# EasyEDA schematic PWM2CV_AtMega_2020-12-24_12-28-22.json
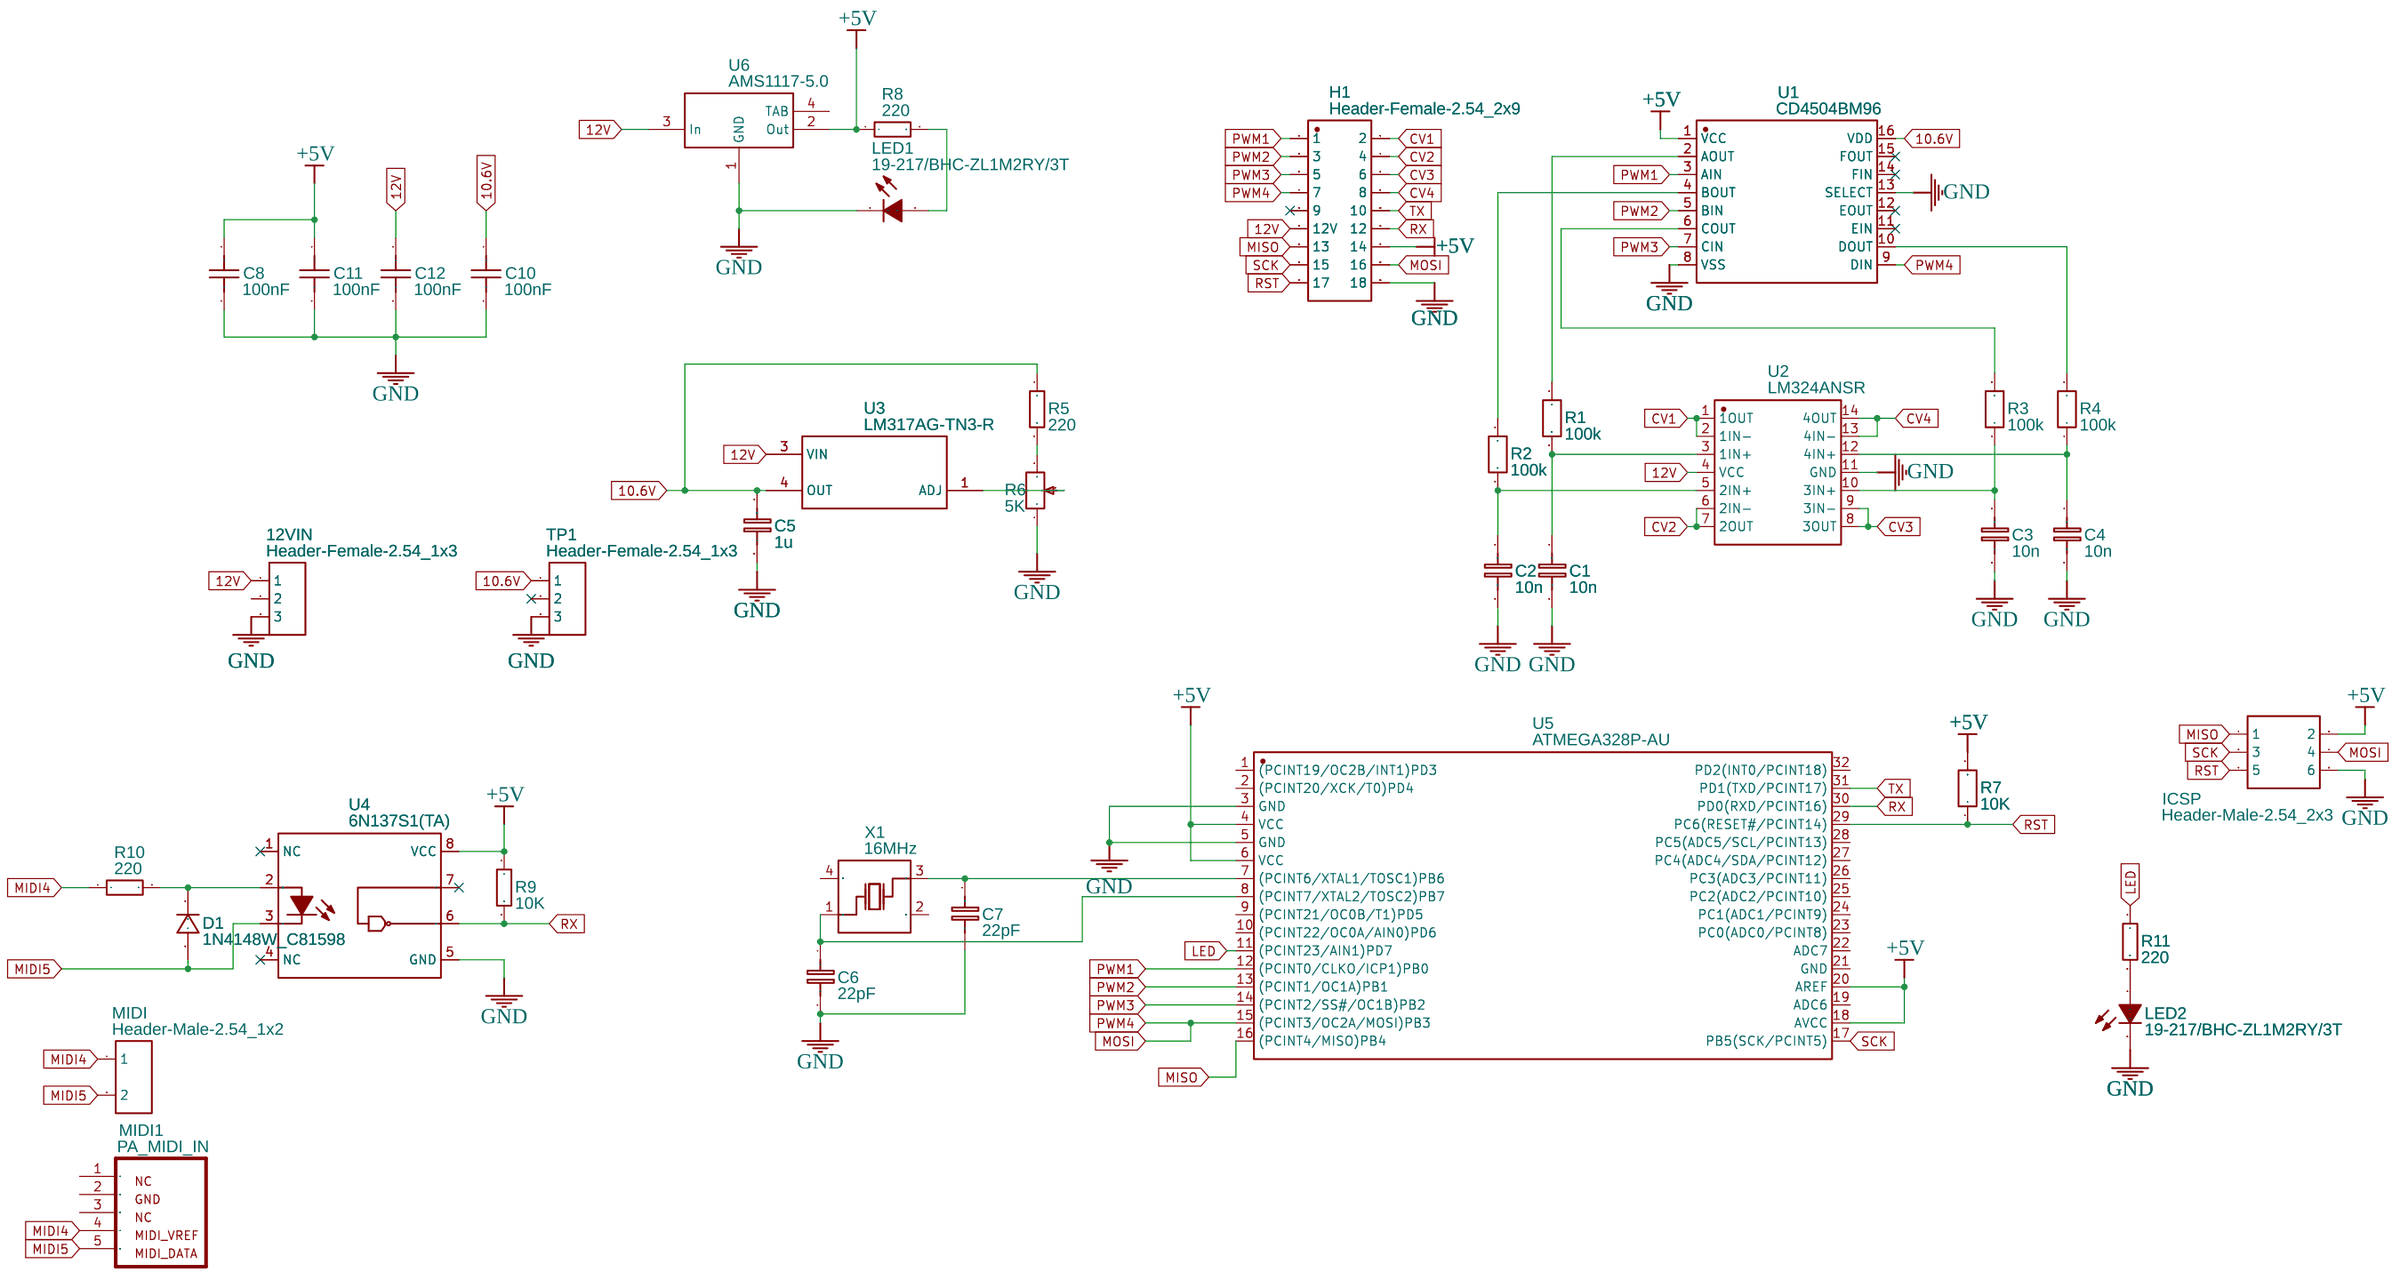
[diagram p0: schematic sheet]

## Parts
12VIN  Header-Female-2.54_1x3  [HDR-TH_3P-P2.54-V]
C1  10n  [C0603]
C2  10n  [C0603]
C3  10n  [C0603]
C4  10n  [C0603]
C5  1u  [C0603]
C6  22pF  [C0603]
C7  22pF  [C0603]
C8  100nF  [C0603]
C10  100nF  [C0603]
C11  100nF  [C0603]
C12  100nF  [C0603]
D1  1N4148W_C81598  [SOD-123_L2.8-W1.8-LS3.7-RD]
H1  Header-Female-2.54_2x9  [HDR-TH_18P-P2.54-V-R2-C9-S2.54]
ICSP  Header-Male-2.54_2x3  [HDR-TH_6P-P2.54-V-R2-C3-S2.54]
LED1  19-217/BHC-ZL1M2RY/3T  [LED0603-R-RD]
LED2  19-217/BHC-ZL1M2RY/3T  [LED0603-R-RD]
MIDI  Header-Male-2.54_1x2  [HDR-TH_2P-P2.54-V]
MIDI1  PA_MIDI_IN  [PA_DIN_5_FEMALE]
R1  100k  [R0603]
R2  100k  [R0603]
R3  100k  [R0603]
R4  100k  [R0603]
R5  220  [R0603]
R6  5K  [RES-ADJ_3314J]
R7  10K  [R0603]
R8  220  [R0603]
R9  10K  [R0603]
R10  220  [R0603]
R11  220  [R0603]
TP1  Header-Female-2.54_1x3  [HDR-TH_3P-P2.54-V]
U1  CD4504BM96  [SOIC-16_L9.9-W3.9-P1.27-LS6.0-BL]
U2  LM324ANSR  [SOIC-14_L10.0-W5.5-P1.27-LS7.8-BL]
U3  LM317AG-TN3-R  [TO-252-2_L6.5-W6.1-P4.58-LS10.0-TL]
U4  6N137S1(TA)  [SMD-8_L9.8-W6.6-P2.54-LS10.3-BL]
U5  ATMEGA328P-AU  [TQFP-32_L7.0-W7.0-P0.80-LS9.0-BL]
U6  AMS1117-5.0  [SOT-223_L6.5-W3.5-P2.30-LS7.0-BR]
X1  16MHz  [OSC-SMD_4P-L3.2-W2.5-BL]

## Library data of the parts
12VIN TP1 = Header-Female-2.54_1x3: Supplier Part: C146243; Supplier: LCSC; Manufacturer: Boom Precision Elec; link: https://datasheet.lcsc.com/szlcsc/Boom-Precision-Elec-2-54mm-1-8P-Straight-Female-header_C27438.pdf
C1-C4 = C_0603_EU: Supplier Part: C57112; Supplier: LCSC; Contributor: LCEDA_Lib; Manufacturer Part: 0603B103K500NT; Manufacturer: FH
C5 = C_0603_EU: Supplier Part: C15849; Supplier: LCSC; Contributor: LCEDA_Lib; Manufacturer Part: CL10A105KB8NNNC; Manufacturer: SAMSUNG
C6 C7 = C_0603_EU: Supplier Part: C1653; Supplier: LCSC; Contributor: LCEDA_Lib; Manufacturer Part: CL10C220JB8NNNC; Manufacturer: SAMSUNG
C8 C10-C12 = CC0603KRX7R9BB104: Supplier: LCSC; Manufacturer: YAGEO; LCSC Assembly: Yes; Supplier Part: C14663; SMT Type: Basic
D1 = 1N4148W_C81598: Supplier: LCSC; Manufacturer: SEMTECH; Manufacturer Part: 1N4148W; image: //image.lceda.cn/szlcsc/C81598.jpg; Supplier Part: C81598; LCSC Assembly: Yes; SMT Type: Basic
H1 = Header-Female-2.54_2x9: Supplier: LCSC; Manufacturer: BOOMELE; image: //image.lceda.cn/szlcsc/C71956.jpg; Supplier Part: C71956
ICSP = Header-Male-2.54_2x3: Supplier: LCSC; Manufacturer: BOOMELE; Supplier Part: C65114
LED1 LED2 = 19-217/BHC-ZL1M2RY/3T: Supplier: LCSC; Manufacturer: EVERLIGHT; LCSC Assembly: Yes; image: //image.lceda.cn/szlcsc/C72041.jpg; Supplier Part: C72041; SMT Type: Basic
MIDI = Header-Male-2.54_1x2: Supplier: LCSC; Manufacturer: TE Connectivity; Manufacturer Part: 826629-2; image: //image.lceda.cn/szlcsc/C86471.jpg; Supplier Part: C86471
MIDI1 = PA_MIDI_OUT: PatternAgents MIDI OUT Pattern; Contributor: PatternAgents
R1-R4 = R_0603_EU: Supplier Part: C25803; Supplier: LCSC; Contributor: LCEDA_Lib; Manufacturer Part: 0603WAF1003T5E; Manufacturer: UniOhm
R5 R8 R10 R11 = 0603WAF2200T5E: Supplier: LCSC; Manufacturer: UniOhm; LCSC Assembly: Yes; Supplier Part: C22962; SMT Type: Basic
R6 = 3314J-1-502E: Supplier: LCSC; Manufacturer: BOURNS; Supplier Part: C58391
R7 = R_0603_EU: Supplier Part: C25803; Supplier: LCSC; Contributor: LCEDA_Lib; Manufacturer Part: 0603WAF1003T5E; Manufacturer: UniOhm; Package Display: No
R9 = 0603WAF1002T5E: Supplier: LCSC; Manufacturer: UniOhm; LCSC Assembly: Yes; Supplier Part: C25804; SMT Type: Basic
U1 = CD4504BM96: Supplier: LCSC; Supplier Part: C151885; Manufacturer: Texas Instruments; Contributor: LCSC; LCSC Assembly: Yes; SMT Type: Extend
U2 = LM324ANSR: Supplier: LCSC; Manufacturer: TI; Supplier Part: C111853; LCSC Assembly: Yes; SMT Type: Extend
U3 = LM317AG-TN3-R: Supplier: LCSC; Manufacturer: UTC; LCSC Assembly: Yes; image: //image.lceda.cn/szlcsc/C75510.jpg; Supplier Part: C75510; SMT Type: Basic
U4 = 6N137S1(TA): Supplier: LCSC; Supplier Part: C110020; Manufacturer: Everlight Elec; Contributor: LCSC; SMT Type: Basic; LCSC Assembly: Yes
U5 = ATMEGA328P-AU: Supplier: LCSC; Manufacturer: MICROCHIP; image: //image.lceda.cn/szlcsc/C14877.jpg; Supplier Part: C14877; LCSC Assembly: Yes; SMT Type: Basic
U6 = AMS1117-5.0: sourceId: HltLFyQwq; Supplier: LCSC; Manufacturer: AMS; LCSC Assembly: Yes; image: //image.lceda.cn/szlcsc/C6187.jpg; Supplier Part: C6187; SMT Type: Basic
X1 = X322516MLB4SI: Supplier: LCSC; Manufacturer: YXC; LCSC Assembly: Yes; Supplier Part: C13738; SMT Type: Basic

## Nets
10.6V: C5.1 C10.1 R5.1 TP1.1 U1.16(VDD) U3.4(OUT)
12V: 12VIN.1 C12.1 H1.11(12V) U2.4(VCC) U3.3(VIN) U6.3(In)
+5V: C8.1 C11.1 H1.14 ICSP.2 R7.2 R8.1 R9.1 U1.1(VCC) U4.8(VCC) U5.4(VCC) U5.6(VCC) U5.18(AVCC) U5.20(AREF) U6.2(Out)
GND: 12VIN.3 C1.2 C2.2 C3.2 C4.2 C5.2 C6.2 C7.2 C8.2 C10.2 C11.2 C12.2 H1.18 ICSP.6 LED1.2(C) LED2.2(C) R6.1 TP1.3 U1.8(VSS) U1.13(SELECT) U2.11(GND) U4.5(GND) U5.3(GND) U5.5(GND) U6.1(GND)
CV1: H1.2 U2.1(1OUT) U2.2(1IN-)
CV2: H1.4 U2.6(2IN-) U2.7(2OUT)
CV3: H1.6 U2.8(3OUT) U2.9(3IN-)
CV4: H1.8 U2.13(4IN-) U2.14(4OUT)
LED: R11.1 U5.11((PCINT23/AIN1)PD7)
MIDI4: MIDI.1 MIDI1.4 R10.1
MIDI5: D1.2(A) MIDI.2 MIDI1.5 U4.3(CAT)
MISO: H1.13 ICSP.1 U5.16((PCINT4/MISO)PB4)
MOSI: H1.7 H1.16 ICSP.4 U1.9(DIN) U5.15((PCINT3/OC2A/MOSI)PB3)
PWM1: H1.1 U1.3(AIN) U5.12((PCINT0/CLKO/ICP1)PB0)
PWM2: H1.3 U1.5(BIN) U5.13((PCINT1/OC1A)PB1)
PWM3: H1.5 U1.7(CIN) U5.14((PCINT2/SS#/OC1B)PB2)
RST: H1.17 ICSP.5 R7.1 U5.29(PC6(RESET#/PCINT14))
RX: H1.12 R9.2 U4.6(VOUT) U5.30(PD0(RXD/PCINT16))
SCK: H1.15 ICSP.3 U5.17(PB5(SCK/PCINT5))
TX: H1.10 U5.31(PD1(TXD/PCINT17))
Net-(C1-1): C1.1 R1.2 U2.3(1IN+)
Net-(C2-1): C2.1 R2.2 U2.5(2IN+)
Net-(C3-1): C3.1 R3.1 U2.10(3IN+)
Net-(C4-1): C4.1 R4.1 U2.12(4IN+)
Net-(C6-1): C6.1 U5.8((PCINT7/XTAL2/TOSC2)PB7) X1.1(OSC1)
Net-(C7-1): C7.1 U5.7((PCINT6/XTAL1/TOSC1)PB6) X1.3(OSC2)
Net-(D1-1): D1.1(K) R10.2 U4.2(AN)
Net-(LED1-1): LED1.1(A) R8.2
Net-(LED2-1): LED2.1(A) R11.2
Net-(R1-1): R1.1 U1.2(AOUT)
Net-(R2-1): R2.1 U1.4(BOUT)
Net-(R3-2): R3.2 U1.6(COUT)
Net-(R4-2): R4.2 U1.10(DOUT)
Net-(R5-2): R5.2 R6.3
Net-(R6-2): R6.2 U3.1(ADJ)

Not connected (* = marked no-connect by the designer): 12VIN 2; H1 9*; MIDI1 1 2 3; TP1 2*; U1 11(EIN)* 12(EOUT)* 14(FIN)* 15(FOUT)*; U4 1(NC)* 4(NC)* 7(VE)*; U5 1((PCINT19/OC2B/INT1)PD3) 2((PCINT20/XCK/T0)PD4) 9((PCINT21/OC0B/T1)PD5) 10((PCINT22/OC0A/AIN0)PD6) 19(ADC6) 21(GND) 22(ADC7) 23(PC0(ADC0/PCINT8)) 24(PC1(ADC1/PCINT9)) 25(PC2(ADC2/PCINT10)) 26(PC3(ADC3/PCINT11)) 27(PC4(ADC4/SDA/PCINT12)) 28(PC5(ADC5/SCL/PCINT13)) 32(PD2(INT0/PCINT18)); U6 4(TAB); X1 2(GND) 4(GND)
